# EAGLE schematic LM317 (EAGLE 7.1.0)
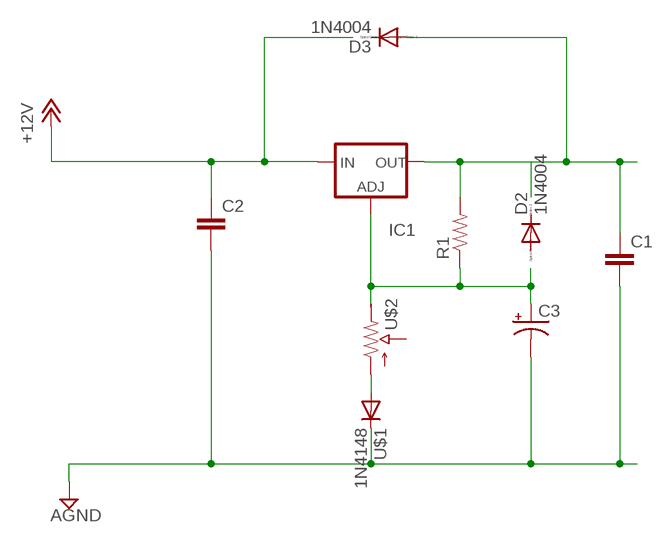
[diagram p0: schematic, sheet 1]

## Parts
C1  CAPKIT  [CAP-PTH-SMALL-KIT]
C2  CAPKIT  [CAP-PTH-SMALL-KIT]
C3  CAP_POLPTH2  [CPOL-RADIAL-10UF-25V]
D2  1N4004  [DO41-10]
D3  1N4004  [DO41-10]
IC1  LM337TS  [337TS]
R1  RESISTORAXIAL-0.3  [AXIAL-0.3]
U$1  1N4148  [DO34-5]
U$2  POT100K_3362U  [3362U]

## Nets
+12V: C2.1 IC1.2(IN)
AGND: C1.2 C2.2 C3.2(-) U$1.C
N$1: C3.1(+) IC1.1(ADJ) R1.P$1 U$2.P$1(E)
N$2: C1.1 D3.A IC1.3(OUT) R1.P$2
N$6: U$1.A U$2.P$3(A)
Unconnected: D2.A D2.C D3.C U$2.P$2(S)

## Library data of the parts
C1 C2 = SparkFun:CAP: Capacitor Standard 0603 ceramic capacitor, and 0.1" leaded capacitor.
C3 = SparkFun:CAP_POL: Capacitor Polarized These are standard SMD and PTH capacitors. Normally 10uF, 47uF, and 100uF in electrolytic and tantalum varieties. Always verify the external diameter of the through hole cap, it varies with capacity, voltage, and manufacturer. The EIA devices should be standard.
D2 D3 = diode:1N4004: DIODE general purpose rectifier, 1 A
IC1 = v-reg:LM337TS: VOLTAGE REGULATOR
R1 = My Library:RESISTOR: Resistor Basic schematic elements and footprints for 0603, 1206, and PTH resistors.
U$1 = My Library:1N4148
U$2 = My Library:POT